# EAGLE design schV2.2 (EAGLE 9.6.2)
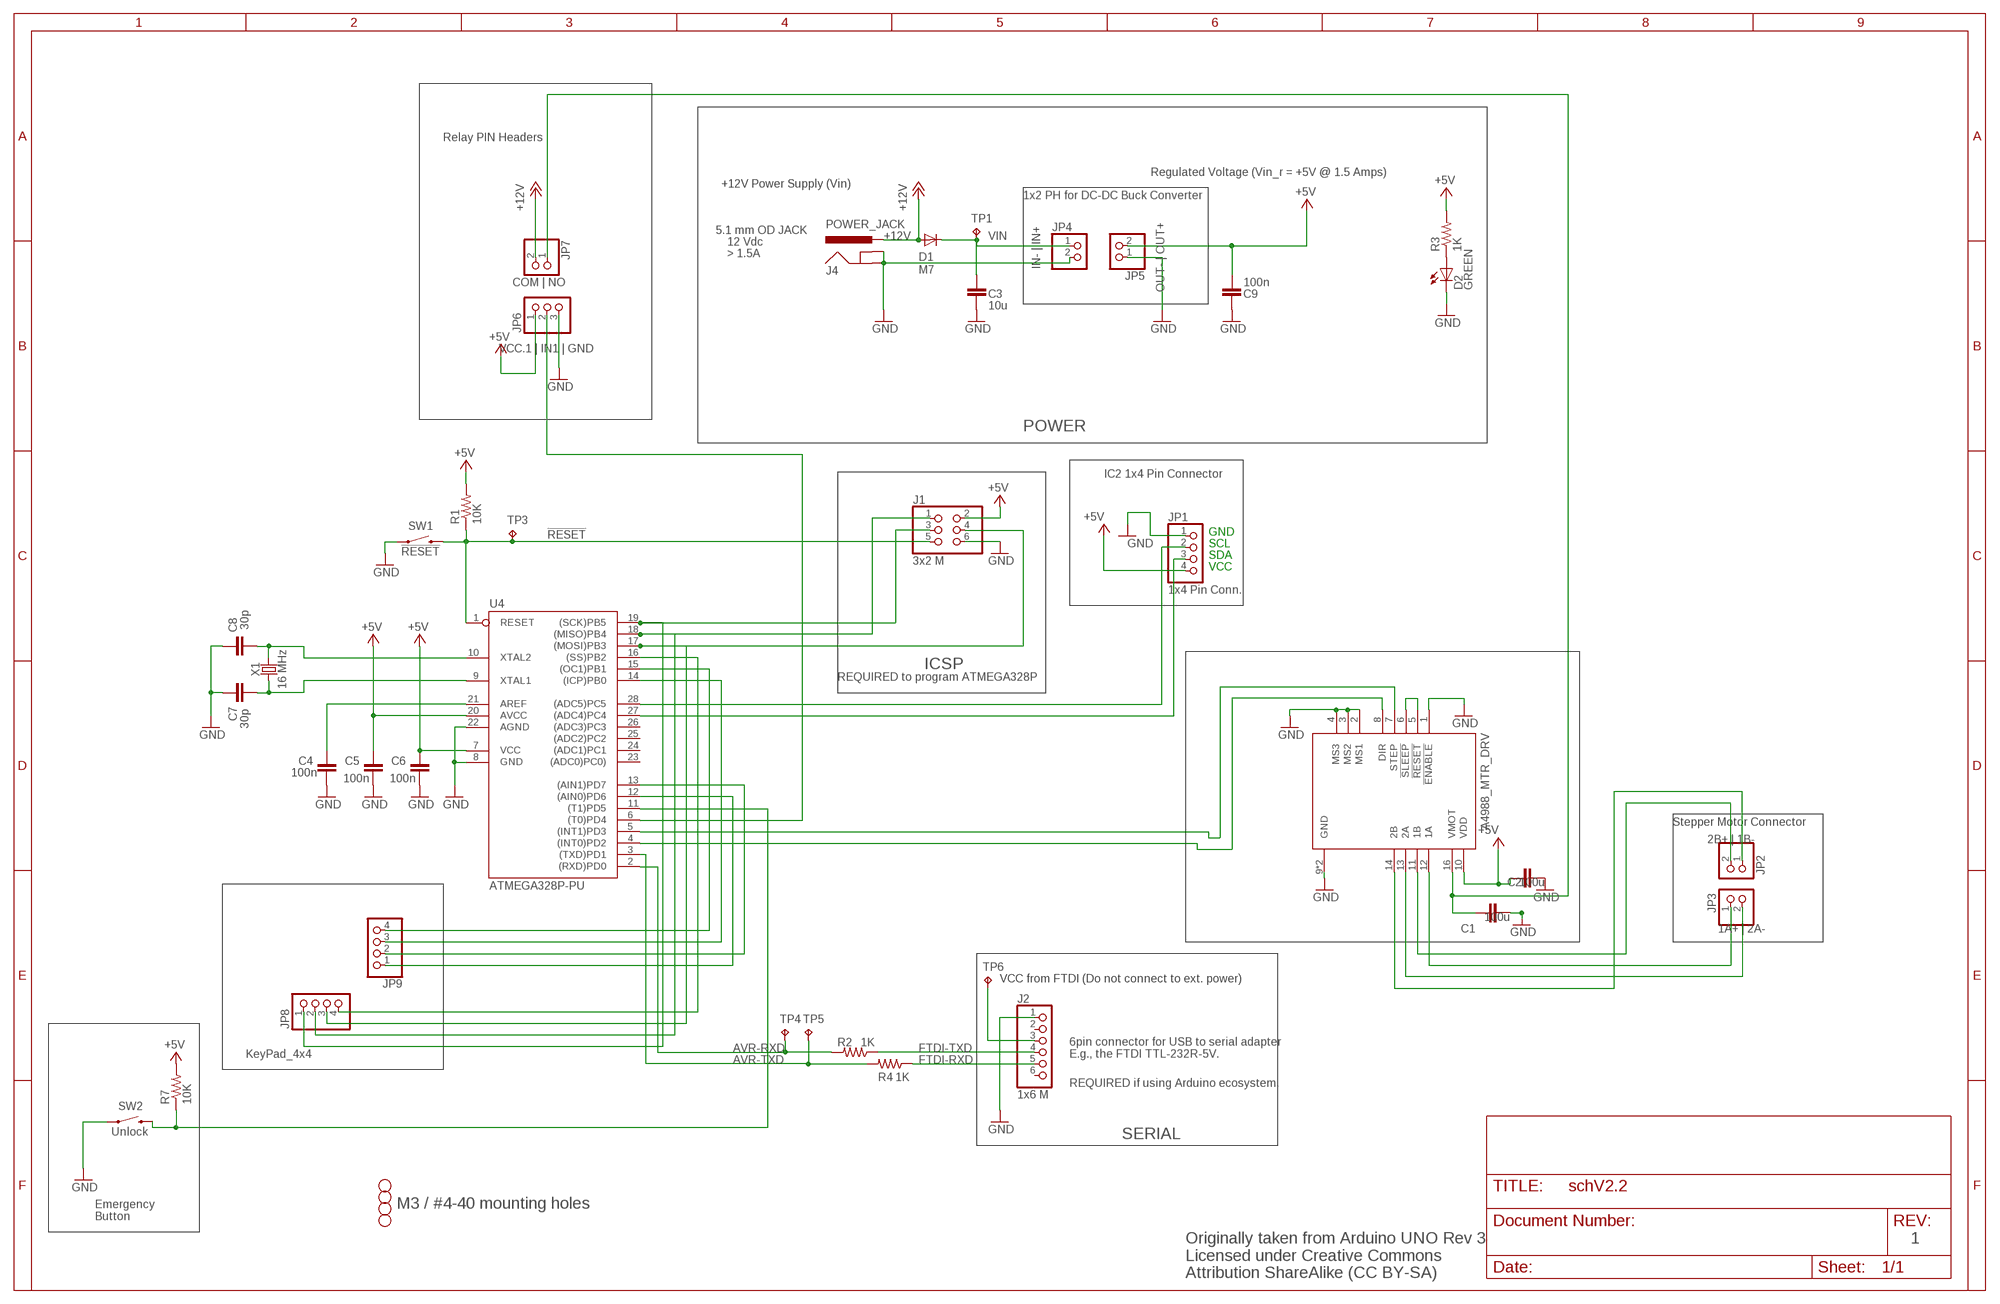
[diagram p0: schematic, sheet 1]

## Parts
A4988_MTR_DRV  A4988_STEPPER_MOTOR_DRIVER_CARRIER  [MODULE_A4988_STEPPER_MOTOR_DRIVER_CARRIER]
C1  100u  C-EUC0805K  [C0805K]
C2  100u  C-EUC0805K  [C0805K]
C3  10u  C-EUC0805K  [C0805K]
C4  100n  C-EUC0805K  [C0805K]
C5  100n  C-EUC0805K  [C0805K]
C6  100n  C-EUC0805K  [C0805K]
C7  30p  C-EUC0805K  [C0805K]
C8  30p  C-EUC0805K  [C0805K]
C9  100n  C-EUC0805K  [C0805K]
D1  M7  DIODE-SMB  [SMB]
D2  GREEN  LEDCHIP-LED0805  [CHIP-LED0805]
H1  STAND-OFF  [STAND-OFF]
H2  STAND-OFF  [STAND-OFF]
H3  STAND-OFF  [STAND-OFF]
H4  STAND-OFF  [STAND-OFF]
J1  3x2 M  PINHD-2X3  [2X03]
J2  1x6 M  PINHD-1X6  [1X06]
J4  POWER_JACK  [POWER_JACK_PTH]
JP1  1x4 Pin Conn.  PINHD-1X4  [1X04]
JP2  2B+ | 1B-  PINHD-1X2  [1X02]
JP3  1A+ | 2A-  PINHD-1X2  [1X02]
JP4  IN- | IN+  PINHD-1X2  [1X02]
JP5  OUT- | OUT+  PINHD-1X2  [1X02]
JP6  VCC.1 | IN1 | GND  PINHD-1X3  [1X03]
JP7  COM | NO  PINHD-1X2  [1X02]
JP8  PINHD-1X4  [1X04]
JP9  PINHD-1X4  [1X04]
R1  10K  R-US_R0805  [R0805]
R2  1K  R-US_R0805  [R0805]
R3  1K  R-US_R0805  [R0805]
R4  1K  R-US_R0805  [R0805]
R7  10K  R-US_R0805  [R0805]
SW1  !RESET  SWITCH-MOMENTARY-2SMD  [TACTILE_SWITCH_SMD]
SW2  Unlock  SWITCH-MOMENTARY-2SMD  [TACTILE_SWITCH_SMD]
TP1  TPPAD1-13  [P1-13]
TP3  TPPAD1-13  [P1-13]
TP4  TPPAD1-13  [P1-13]
TP5  TPPAD1-13  [P1-13]
TP6  TPPAD1-13  [P1-13]
U4  ATMEGA328P-PU  [DIL28-3]
X1  16 MHz  CRYSTALSMD-HC49UP  [HC49UP]

## Nets
!RESET: J1.5 R1.1 SW1.3 TP3.TP U4.1(RESET)
+5V: A4988_MTR_DRV.10(VDD) C2.2 C5.2 C6.2 C9.2 J1.2 JP1.4 JP5.2 JP6.1 R1.2 R3.2 R7.2 U4.7(VCC) U4.20(AVCC)
+12V: D1.A J4.PWR JP7.2
AVR-RXD: R2.2 TP4.TP U4.2((RXD)PD0)
AVR-TXD: R4.2 TP5.TP U4.3((TXD)PD1)
FTDI-RXD: J2.5 R4.1
FTDI-TXD: J2.4 R2.1
GND: A4988_MTR_DRV.1(!ENABLE) A4988_MTR_DRV.2(MS1) A4988_MTR_DRV.3(MS2) A4988_MTR_DRV.4(MS3) A4988_MTR_DRV.9(GND) A4988_MTR_DRV.15(GND) C1.1 C2.1 C3.2 C4.1 C5.1 C6.1 C7.2 C8.2 C9.1 D2.C J1.6 J2.1 J4.GND J4.GNDBREAK JP1.1 JP4.2 JP5.1 JP6.3 SW1.1 SW2.1 U4.8(GND) U4.22(AGND)
MISO: J1.1 JP8.2 U4.18((MISO)PB4)
MOSI: J1.4 JP8.3 U4.17((MOSI)PB3)
N$1: C4.2 U4.21(AREF)
N$2: A4988_MTR_DRV.8(DIR) U4.4((INT0)PD2)
N$3: D2.A R3.1
N$4: A4988_MTR_DRV.7(STEP) U4.5((INT1)PD3)
N$5: J2.3 TP6.TP
N$6: JP1.3 U4.27((ADC4)PC4)
N$8: A4988_MTR_DRV.11(1B) JP2.2
N$9: A4988_MTR_DRV.12(1A) JP3.1
N$10: A4988_MTR_DRV.13(2A) JP3.2
N$11: A4988_MTR_DRV.14(2B) JP2.1
N$12: JP1.2 U4.28((ADC5)PC5)
N$14: JP9.1 U4.12((AIN0)PD6)
N$15: JP9.2 U4.13((AIN1)PD7)
N$16: JP9.3 U4.14((ICP)PB0)
N$17: JP9.4 U4.15((OC1)PB1)
N$18: JP8.4 U4.16((SS)PB2)
N$20: JP6.2 U4.6((T0)PD4)
N$21: R7.1 SW2.3 U4.11((T1)PD5)
N$22: A4988_MTR_DRV.5(!RESET) A4988_MTR_DRV.6(!SLEEP)
N$23: A4988_MTR_DRV.16(VMOT) C1.2 JP7.1
SCK: J1.3 JP8.1 U4.19((SCK)PB5)
VIN: C3.1 D1.C JP4.1 TP1.TP
XTAL1: C7.1 U4.9(XTAL1) X1.1
XTAL2: C8.1 U4.10(XTAL2) X1.2
Unconnected: J2.2 J2.6 U4.23((ADC0)PC0)) U4.24((ADC1)PC1) U4.25((ADC2)PC2) U4.26((ADC3)PC3)

## Notes on the sheet
- Relay PIN Headers
- Regulated Voltage (Vin_r = +5V @ 1.5 Amps)
- +12V Power Supply (Vin)
- 1x2 PH for DC-DC Buck Converter
- 5.1 mm OD JACK
- 12 Vdc
- > 1.5A
- POWER
- IC2 1x4 Pin Connector
- GND
- SCL
- SDA
- VCC
- ICSP
- REQUIRED to program ATMEGA328P
- Stepper Motor Connector
- VCC from FTDI (Do not connect to ext. power)
- KeyPad_4x4
- 6pin connector for USB to serial adapter
  E.g., the FTDI TTL-232R-5V.
- REQUIRED if using Arduino ecosystem.
- SERIAL
- M3 / #4-40 mounting holes
- Emergency
  Button
- 1
- Originally taken from Arduino UNO Rev 3
  Licensed under Creative Commons 
  Attribution ShareAlike (CC BY-SA)

## Library data of the parts
A4988_MTR_DRV = A4988_STEPPER_MOTOR_DRIVER_CARRIER:A4988_STEPPER_MOTOR_DRIVER_CARRIER: Stepper motor controler; IC: A4988; 1A; Uin mot: 8÷35V; AVAILABILITY: Unavailable; DESCRIPTION: Stepper Motor Driver; MF: Pololu; MP: A4988 STEPPER MOTOR DRIVER CARRIER; PACKAGE: None; PRICE: None
C1 C2 C4-C6 C9 = rcl:C-EU: CAPACITOR, European symbol; MFR: Samsung; MPN: CL21B104KBCNNNC; SPICEPREFIX: C
C3 = rcl:C-EU: CAPACITOR, European symbol; MFR: Samsung; MPN: CL21A106KOQNNNG; SPICEPREFIX: C
C7 = rcl:C-EU: CAPACITOR, European symbol; DESC: CAP CER 30PF 50V C0G/NP0 0805; MFR: Samsung; MPN: CL21C180JBANNNC; SPICEPREFIX: C
C8 = rcl:C-EU: CAPACITOR, European symbol; DESC: CAP CER 30PF 50V C0G/NP0 0805; MFR: Samsung; MPN: CL21C300JBANNNC; SPICEPREFIX: C
D1 = diode:DIODE-: DIODE; MFR: SMC Diode; MPN: 10BQ030TR
D2 = led:LED: LED OSRAM: - CHIPLED LG R971, LG N971, LY N971, LG Q971, LY Q971, LO R971, LY R971 LH N974, LH R974 LS Q976, LO Q976, LY Q976 LO Q996 - Hyper CHIPLED LW Q18S LB Q993, LB Q99A, LB R99A - SideLED LS A670, LO A670, LY A670, LG A670, LP A670 LB A673, LV A673, LT A673, LW A673 LH A674 LY A675 LS A676, LA A676, LO A676, LY A676, LW A676 LS A679, LY A679, LG A679 - Hyper Micro SIDELED® LS Y876, LA Y876, LO Y876, LY Y876 LT Y87S - SmartLED LW L88C, LW L88S LB L89C, LB L89S, LG L890 LS L89K, LO L89K, LY L89K LS L896, LA L896, LO L896, LY L896 - TOPLED LS T670, LO T670, LY T670, LG T670, LP T670 LSG T670, LSP T670, LSY T670, LOP T670, LYG T670 LG T671, LOG T671, LSG T671 LB T673, LV T673, LT T673, LW T673 LH T674 LS T676, LA T676, LO T676, LY T676, LB T676, LH T676, LSB T676, LW T676 LB T67C, LV T67C, LT T67C, LS T67K, LO T67K, LY T67K, LW E67C LS E67B, LA E67B, LO E67B, LY E67B, LB E67C, LV E67C, LT E67C LW T67C LS T679, LY T679, LG T679 LS T770, LO T770, LY T770, LG T770, LP T770 LB T773, LV T773, LT T773, LW T773 LH T774 LS E675, LA E675, LY E675, LS T675 LS T776, LA T776, LO T776, LY T776, LB T776 LHGB T686 LT T68C, LB T68C - Hyper Mini TOPLED® LB M676 - Mini TOPLED Santana® LG M470 LS M47K, LO M47K, LY M47K Source: http://www.osram.convergy.de LUXEON: - LUMILED® LXK2-PW12-R00, LXK2-PW12-S00, LXK2-PW14-U00, LXK2-PW14-V00 LXK2-PM12-R00, LXK2-PM12-S00, LXK2-PM14-U00 LXK2-PE12-Q00, LXK2-PE12-R00, LXK2-PE12-S00, LXK2-PE14-T00, LXK2-PE14-U00 LXK2-PB12-K00, LXK2-PB12-L00, LXK2-PB12-M00, LXK2-PB14-N00, LXK2-PB14-P00, LXK2-PB14-Q00 LXK2-PR12-L00, LXK2-PR12-M00, LXK2-PR14-Q00, LXK2-PR14-R00 LXK2-PD12-Q00, LXK2-PD12-R00, LXK2-PD12-S00 LXK2-PH12-R00, LXK2-PH12-S00 LXK2-PL12-P00, LXK2-PL12-Q00, LXK2-PL12-R00 Source: www.luxeon.com KINGBRIGHT: KA-3528ASYC Source: www.kingbright.com; MFR: Würth Elektronik; MPN: 150080GS75000
H1-H4 = SparkFun-Hardware:STAND-OFF: Stand Off Drill holes for mechanically mounting via screws, standoffs, etc. Note: Use the keepout ring to avoid running the screw head into surrounding components. Variant Overviews STAND-OFF - Mechanical footprint for a #4 phillips button head screw. STAND-OFF-TIGHT - Mechanical footprint for a #4 phillips button head screw, Example SparkFun Products Screw - Phillips Head (1/4", 4-40, 10 pack) <https://www.sparkfun.com/products/10453> (PRT-10453) Screw - Phillips Head (1/2", 4-40, 10 pack) <https://www.sparkfun.com/products/10452> (PRT-10452) Screw - Phillips Head (3/4", 4-40, 10 pack) <https://www.sparkfun.com/products/10451> (PRT-10451) Screw - Phillips Head (1", 4-40, 10 pack) <https://www.sparkfun.com/products/10450> (PRT-10450)
J1 = SmartPrj:PINHD-2X3: PIN HEADER; MFR: Harwin; MPN: M20-9980345
J2 = pinhead:PINHD-1X6: PIN HEADER; MFR: Sullins; MPN: PRPC006SAAN-RC
J4 = SparkFun-Connectors:POWER_JACK: Power Jack Connector This is the standard 5.5mm barrel jack for power. The PTH is the most common, proven, reliable, footprint. The Slot footprint only works if the mill layer is transmitted to the PCB fab house so be warned. Here are the connectors we sell at SparkFun: DC Barrel Power Jack/Connector <https://www.sparkfun.com/products/119> (PRT-00119) DC Barrel Power Jack/Connector (SMD) <https://www.sparkfun.com/products/12748> (PRT-12748) DC Barrel Jack Adapter - Breadboard Compatible <https://www.sparkfun.com/products/10811> (PRT-10811) It is used on this SparkFun product (and many, many others): SparkFun RedBoard - Programmed with Arduino <https://www.sparkfun.com/products/12757> (DEV-12757) Also, if you need a mating power supply or connector, please check these out: Wall Adapter Power Supply - 9VDC 650mA <https://www.sparkfun.com/products/298> (TOL-00298) DC Barrel Jack Adapter - Male <https://www.sparkfun.com/products/10287> (PRT-10287); MFR: CUI; MPN: PJ-202A; PROD_ID: CONN-08197
JP1 JP8 JP9 = pinhead:PINHD-1X4: PIN HEADER
JP2-JP5 JP7 = pinhead:PINHD-1X2: PIN HEADER
JP6 = pinhead:PINHD-1X3: PIN HEADER
R1 R7 = rcl:R-US_: RESISTOR, American symbol; MFR: Yageo; MPN: RC0805FR-0710KL; SPICEPREFIX: R
R2-R4 = rcl:R-US_: RESISTOR, American symbol; MFR: Yageo; MPN: RC0805FR-071KL; SPICEPREFIX: R
SW1 SW2 = SparkFun-Electromechanical:SWITCH-MOMENTARY-2: Various NO switches- pushbuttons, reed, etc; DESC: SWITCH TACTILE SPST-NO 0.05A 12V; MFR: C&K; MPN: RS-187R05A2-DS MT RT
TP1 TP3-TP6 = testpad:TP: Test pad
U4 = SmartPrj:ATMEGA328P-: MICROCONTROLLER 4 Kbytes FLASH 128 bytes SRAM 256 bytes EEPROM UART 6-channel 10 bit ADC; MFR: Microchip; MPN: ATMEGA328P-PU
X1 = SparkFun-Clocks:CRYSTAL: Crystals (Generic) These are passive quartz crystals, which can be used as a clock source for a microcontroller. Crystal's are two-terminal devices. They require external "load" capacitors to generate an oscillating signal.; DESC: CRYSTAL 16.000 MHZ 18PF SMD; MFR: ECS; MPN: ECS-160-18-5PX-TR

## Net classes
0 default: width 1.27 mm, clearance 0.254 mm

## Board
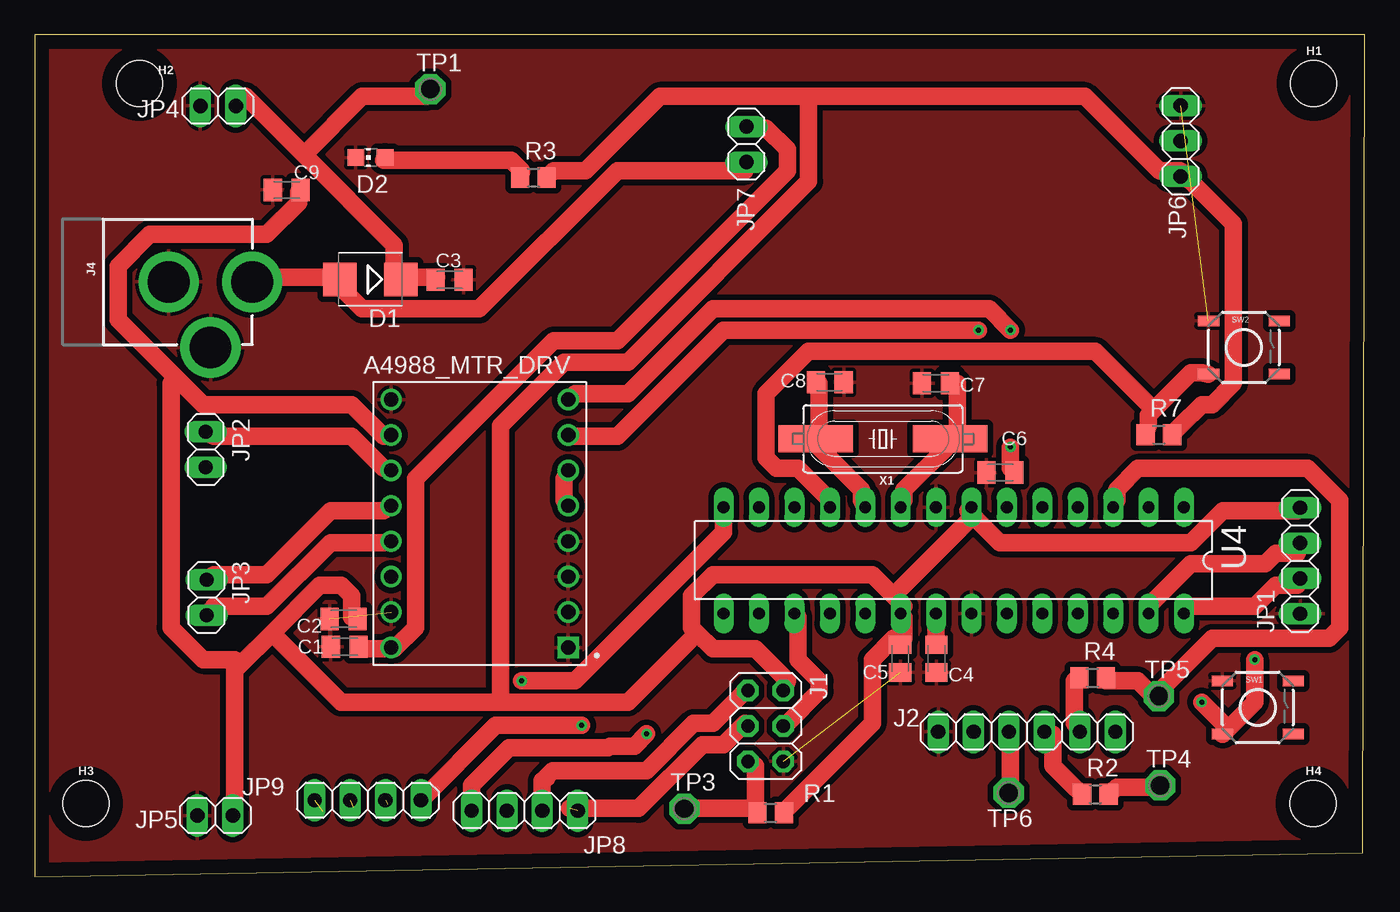
[diagram p1: board, top side]
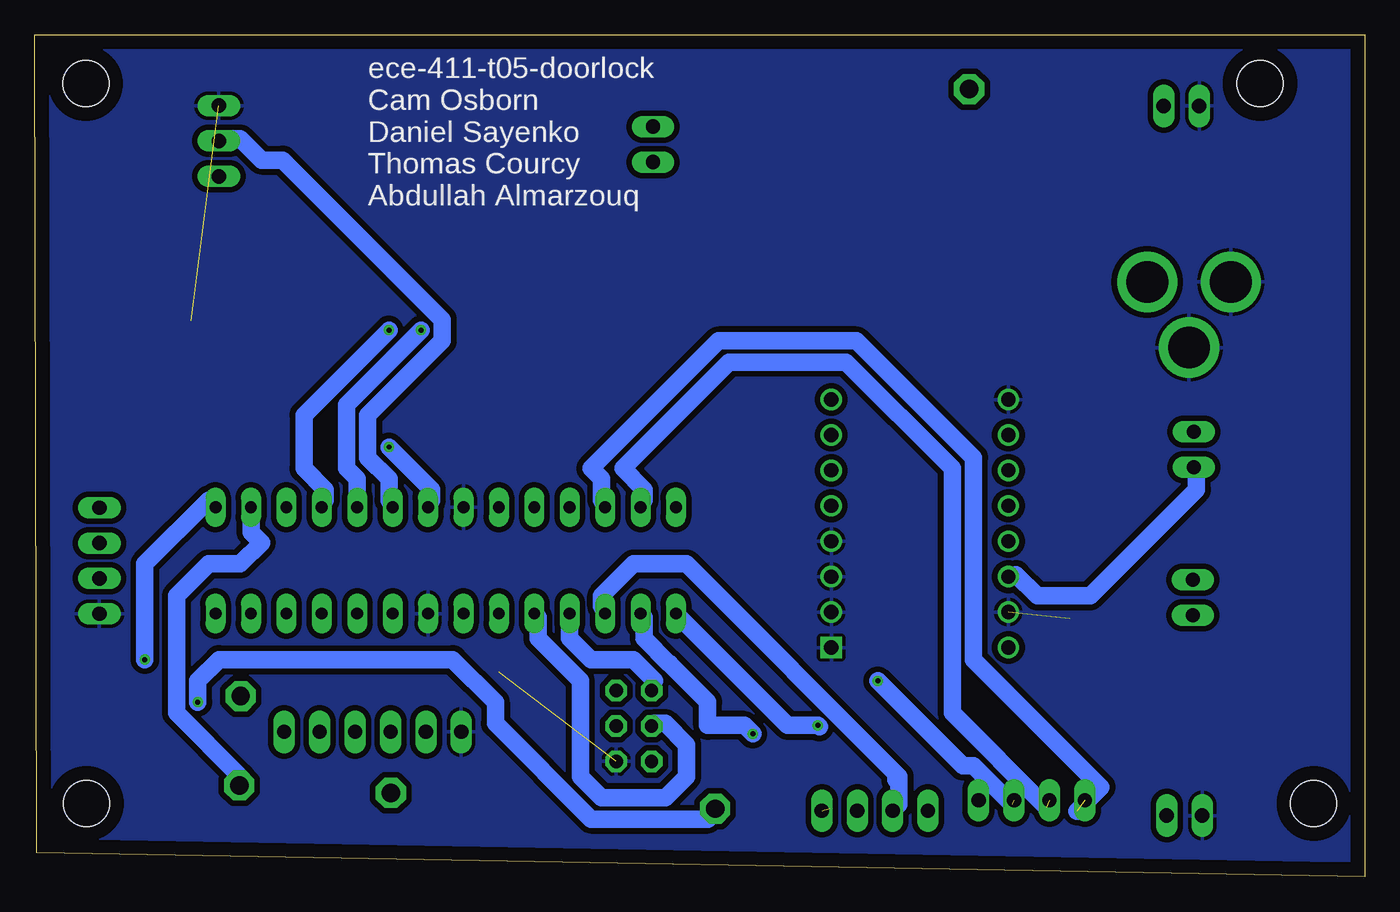
[diagram p2: board, bottom side, seen from below]

Size 95.38 x 60.38 mm. Coordinates in mm from the lower left corner, seen from the top.
Outline: 0,0 95.25,1.75 95.38,60.38 0,60.38 0,0
Copper layers (1*16): Top 0.035mm / dielectric 1.5mm / Bottom 0.035mm
Design rules "default": minimum track width 6mil, minimum drill 0.35mm, track to track 6mil, track to pad 6mil, pad to pad 6mil, via to via 6mil, smd to smd 6mil, copper to edge 40mil, drill to drill 6mil, minimum pad ring 10mil, minimum via ring 8mil, stop-mask expansion 4mil, vias tented up to drill 0mil, thermal gap 10mil

### Footprints (pad centres in the part's own frame; a part is rotated, then mirrored left to right if it is on the bottom)
MODULE_A4988_STEPPER_MOTOR_DRIVER_CARRIER = drill 1.02 square: 1 -6.35,8.89 | drill 1.02: 2 -6.35,6.35; 3 -6.35,3.81; 4 -6.35,1.27; 5 -6.35,-1.27; 6 -6.35,-3.81; 7 -6.35,-6.35; 8 -6.35,-8.89; 9 6.35,-8.89; 10 6.35,-6.35; 11 6.35,-3.81; 12 6.35,-1.27; 13 6.35,1.27; 14 6.35,3.81; 15 6.35,6.35; 16 6.35,8.89
C0805K = smd 1.3 x 1.6: 1 -1,0; 2 1,0
SMB = smd 2.4 x 2.4: A 2.2,0; C -2.2,0
CHIP-LED0805 = smd 1.2 x 1.2: A 0,-1.05; C 0,1.05
STAND-OFF = hole 3.302: 0,0
2X03 = drill 0.95 pad 1.55 octagon: 1 -2.54,-1.27; 2 -2.54,1.27; 3 0,-1.27; 4 0,1.27; 5 2.54,-1.27; 6 2.54,1.27
1X06 = drill 1.016 long: 1 -6.35,0; 2 -3.81,0; 3 -1.27,0; 4 1.27,0; 5 3.81,0; 6 6.35,0
POWER_JACK_PTH = drill 2.997 pad 4.318: GND 0,7.7; GNDBREAK 4.7,10.7; PWR 0,13.7
1X04 = drill 1.016 long: 1 -3.81,0; 2 -1.27,0; 3 1.27,0; 4 3.81,0
1X02 = drill 1.016 long: 1 -1.27,0; 2 1.27,0
1X03 = drill 1.016 long: 1 -2.54,0; 2 0,0; 3 2.54,0
R0805 = smd 1.3 x 1.5: 1 -0.95,0; 2 0.95,0
TACTILE_SWITCH_SMD = smd 1.524 x 0.762: 1 -2.54,1.905; 2 2.54,1.905; 3 -2.54,-1.905; 4 2.54,-1.905
P1-13 = drill 1.321 pad 2.159 octagon: TP 0,0
DIL28-3 = drill 0.85 pad 1.422 long: 1 -16.51,-3.81; 2 -13.97,-3.81; 3 -11.43,-3.81; 4 -8.89,-3.81; 5 -6.35,-3.81; 6 -3.81,-3.81; 7 -1.27,-3.81; 8 1.27,-3.81; 9 3.81,-3.81; 10 6.35,-3.81; 11 8.89,-3.81; 12 11.43,-3.81; 13 13.97,-3.81; 14 16.51,-3.81; 15 16.51,3.81; 16 13.97,3.81; 17 11.43,3.81; 18 8.89,3.81; 19 6.35,3.81; 20 3.81,3.81; 21 1.27,3.81; 22 -1.27,3.81; 23 -3.81,3.81; 24 -6.35,3.81; 25 -8.89,3.81; 26 -11.43,3.81; 27 -13.97,3.81; 28 -16.51,3.81
HC49UP = smd 5.334 x 1.93: 1 -4.826,0; 2 4.826,0

### Placement (x,y rotation side)
A4988_MTR_DRV  31.91,25.34 180 top
C1  22.23,16.51 0 top
C2  22.15,18.51 0 top
C3  29.75,42.81 0 top
C4  64.66,15.66 90 top
C5  62.07,15.66 90 top
C6  69.26,28.99 0 top
C7  64.64,35.39 180 top
C8  57.02,35.47 0 top
C9  18.07,49.26 0 top
D1  24.06,42.85 180 top
D2  24.07,51.58 90 top
H1  91.72,56.9 0 top
H2  7.5,56.9 0 top
H3  3.65,5.27 0 top
H4  91.67,5.27 0 top
J1  52.41,10.82 270 top
J2  71.14,10.4 0 top
J4  1.89,42.66 270 top
JP1  90.75,22.67 90 top
JP2  12.25,30.66 90 top
JP3  12.32,20.03 270 top
JP4  13.14,55.28 180 top
JP5  12.93,4.41 0 top
JP6  82.17,52.77 90 top
JP7  51.03,52.53 270 top
JP8  35.12,4.75 180 top
JP9  23.88,5.5 0 top
R1  52.77,4.6 0 top
R2  76.06,5.93 0 top
R3  35.76,50.15 0 top
R4  75.86,14.29 0 top
R7  80.61,31.71 0 top
SW1  87.71,12.15 0 top
SW2  86.71,37.96 0 top
TP1  28.37,56.48 0 top
TP3  46.59,4.89 0 top
TP4  80.71,6.57 0 top
TP5  80.61,12.97 0 top
TP6  69.84,6.03 0 top
U4  65.91,22.7 180 top
X1  60.83,31.41 180 top

### Tracks (layer width: path | path; a pad name or v marks a point on that pad's centre or on a via)
!RESET  (via drill 0.35)
  Top 1.27: 51.68,4.91 51.68,7.96 J1.5 | 51.68,4.91 47.11,4.91 TP3.TP | 51.68,4.91 R1.1 | 85.59,10.63 87.5,12.53 v87.5,15.58 | 85.59,10.63 85.21,10.25 SW1.3 | 85.59,10.63 v83.69,12.53
  Bottom 1.27: v87.5,15.58 87.5,22.44 82.92,27.01 U4.1 | v83.69,12.53 83.69,14.06 82.16,15.58 65.4,15.58 62.35,12.53 62.35,11.01 55.49,4.15 47.11,4.15 TP3.TP
+5V  (via drill 0.35)
  Top 1.27: 55.49,55.97 75.3,55.97 80.64,50.64 82.16,50.64 JP6.1 82.92,49.87 85.97,46.83 85.97,35.39 84.45,33.87 83.69,33.87 82.16,32.35 R7.2 | 55.49,55.97 44.82,55.97 39.49,50.64 37.2,50.64 R3.2 | 14.72,15.2 14.34,14.82 14.34,4.91 JP5.2 | 14.72,15.2 17.01,17.49 | 17.01,17.49 20.44,20.92 21.96,20.92 22.73,20.16 22.73,18.63 C2.2 | 10.15,35.78 12.06,33.87 22.73,33.87 25.01,31.59 A4988_MTR_DRV.10 | 10.15,35.78 5.96,39.97 5.96,43.78 8.25,46.06 16.63,46.06 18.91,48.35 18.91,49.11 C9.2 | 14.72,15.2 14.34,15.58 12.06,15.58 9.77,17.87 9.77,35.39 10.15,35.78 | v69.97,30.82 69.97,29.3 C6.2 | JP1.4 90.54,26.25 85.21,26.25 82.92,23.97 69.21,23.97 66.92,26.25 U4.7 66.92,25.49 61.59,20.16 | R1.2 53.97,4.91 60.06,11.01 60.06,15.58 61.59,17.11 C5.2 62.35,17.11 62.35,18.63 U4.20 62.35,19.39 61.59,20.16 | 47.49,17.49 47.11,17.87 47.11,20.16 48.63,21.68 60.06,21.68 61.59,20.16 | 47.49,17.49 48.63,16.34 51.68,16.34 53.97,14.06 J1.2 | 17.01,17.49 21.96,12.53 33.39,12.53 | 33.39,12.53 42.54,12.53 47.49,17.49 | 55.49,55.97 55.49,49.87 42.54,36.92 37.97,36.92 33.39,32.35 33.39,12.53
  Bottom 1.27: v69.97,30.82 66.92,27.77 66.92,27.01 U4.7
+12V
  Top 1.27: J4.PWR 15.87,43.02 21.2,43.02 D1.A 21.96,42.25 23.49,40.73 31.87,40.73 41.77,50.64 50.92,50.64 JP7.2
AVR-RXD
  Top 1.27: R2.2 77.59,6.44 80.64,6.44 TP4.TP
  Bottom 1.27: U4.2 79.88,24.73 79.11,23.97 80.64,22.44 82.92,22.44 85.21,20.16 85.21,11.77 80.64,7.2 TP4.TP
AVR-TXD
  Top 1.27: R4.2 76.83,14.06 79.11,14.06 79.88,13.3 TP5.TP 80.64,13.3 84.45,17.11 92.83,17.11 93.59,17.87 93.59,27.01 91.31,29.3 79.11,29.3 77.59,27.77 77.59,27.01 U4.3
FTDI-RXD
  Top 1.27: R4.1 74.54,14.06 74.54,11.01 J2.5
FTDI-TXD
  Top 1.27: R2.1 74.54,6.44 73.02,7.96 73.02,10.25 J2.4
GND  (3 unrouted)
  pour Top (isolate 0.406): 0,60.38 0,0 95.25,0 95.25,60.38
  pour Bottom (isolate 0.406): 0,60.38 0,1.12 95.25,1.12 95.25,60.38
MISO
  Top 1.27: J1.1 50.92,13.3 48.63,11.01 47.24,11.01 43.85,7.62 37.12,7.62 36.62,7.12 | 36.75,7.12 36.62,7.12 | 36.62,7.12 36.4,6.9 JP8.2
  Bottom 1.27: U4.18 57.02,17.11 55.49,15.58 52.44,15.58 50.92,14.06 J1.1
MOSI
  Top 1.27: U4.17 54.73,18.63 54.73,15.58 56.25,14.06 56.25,13.3 53.97,11.01 J1.4
  Bottom 1.27: 33.39,7.2 33.63,6.96 | 33.39,7.2 48.63,22.44 52.44,22.44 54.73,20.16 54.73,19.39 U4.17 | 33.39,7.2 33.39,5.21 JP8.3
N$1
  Top 1.27: U4.21 64.64,17.11 C4.2
N$2  (via drill 0.35)
  Top 1.27: v69.97,39.2 68.44,40.73 48.63,40.73 42.54,34.63 38.73,34.63 A4988_MTR_DRV.8
  Bottom 1.27: v69.97,39.2 76.06,33.11 76.06,29.3 74.54,27.77 74.54,27.01 U4.4
N$3
  Top 1.27: D2.A 25.01,51.4 34.16,51.4 34.92,50.64 R3.1
N$4  (via drill 0.35)
  Top 1.27: v67.68,39.2 49.39,39.2 41.77,31.59 38.73,31.59 A4988_MTR_DRV.7
  Bottom 1.27: U4.5 72.25,28.54 73.02,29.3 73.02,33.87 v67.68,39.2
N$5
  Top 1.27: J2.3 69.97,10.25 69.97,6.44 TP6.TP
N$6
  Top 1.27: U4.27 79.88,19.39 82.92,22.44 88.26,22.44 89.02,23.2 90.54,23.2 JP1.3
N$8
  Top 1.27: JP2.2 12.82,31.59 22.73,31.59 25.01,29.3 A4988_MTR_DRV.11
N$9
  Top 1.27: JP3.1 12.82,21.68 16.63,21.68 21.2,26.25 25.01,26.25 A4988_MTR_DRV.12
N$10
  Top 1.27: JP3.2 12.82,19.39 16.63,19.39 21.2,23.97 25.01,23.97 A4988_MTR_DRV.13
N$11
  Bottom 1.27: JP2.1 12.06,29.3 12.06,27.77 19.68,20.16 23.49,20.16 25.01,21.68 A4988_MTR_DRV.14
N$12
  Top 1.27: U4.28 82.92,19.39 87.5,19.39 89.02,20.92 90.54,20.92 JP1.2
N$14  (1 unrouted)
  Bottom 1.27: 20.63,4.72 18.91,6.44 28.06,15.58 28.06,30.06 36.44,38.44 46.35,38.44 55.49,29.3 54.73,28.54 54.73,27.01 U4.12
N$15  (1 unrouted)
  Bottom 1.27: 22.81,5.01 29.58,11.77 29.58,29.3 37.2,36.92 45.59,36.92 53.2,29.3 51.68,27.77 51.68,27.01 U4.13
N$16  (via drill 0.35)  (1 unrouted)
  Top 1.27: U4.14 49.39,24.73 38.73,14.06 v34.92,14.06
  Bottom 1.27: v34.92,14.06 28.82,7.96 28.06,7.96 25.31,5.22
N$17  (via drill 0.35)
  Top 1.27: v39.22,10.88 33.06,10.88 JP9.4
  Bottom 1.27: U4.15 41.38,10.88 v39.22,10.88 39.11,10.76
N$18  (via drill 0.35)
  Top 1.27: JP8.4 31.31,6.56 34.01,9.26 41.13,9.26 41.25,9.39 43,9.39 v43.88,10.26
  Bottom 1.27: U4.16 51.68,18.63 51.68,17.11 49.91,15.34 49.86,15.32 49.82,15.24 47.12,12.55 47.12,10.88 44.49,10.88 v43.88,10.26
N$20
  Bottom 1.27: U4.6 69.97,27.01 69.97,28.54 71.49,30.06 71.49,33.11 66.16,38.44 66.16,39.97 77.59,51.4 79.11,51.4 80.64,52.92 82.16,52.92 JP6.2
N$21
  Top 1.27: 80.26,33.49 82.92,36.16 83.69,36.16 SW2.3 | 80.26,33.49 79.88,33.11 79.88,32.35 R7.1 | 80.26,33.49 76.06,37.68 55.49,37.68 52.44,34.63 52.44,30.06 53.2,29.3 54.73,29.3 57.02,27.01 U4.11
N$22
  Top 1.27: A4988_MTR_DRV.5 37.97,27.01 37.97,28.54 A4988_MTR_DRV.6
N$23
  Top 1.27: C1.2 23.49,16.34 25.01,16.34 A4988_MTR_DRV.16 25.77,16.34 27.3,17.87 27.3,28.54 37.2,38.44 41.77,38.44 53.97,50.64 53.97,52.16 52.44,53.68 51.68,53.68 JP7.1
SCK  (1 unrouted)
  Top 1.27: 38.36,4.91 43.3,4.91 47.87,9.49 49.39,9.49 50.92,11.01 J1.3
  Bottom 1.27: U4.19 59.3,18.63 59.3,17.11 56.25,14.06 56.25,7.2 54.73,5.68 50.16,5.68 48.63,7.2 48.63,9.49 50.16,11.01 50.92,11.01 J1.3
VIN
  Top 1.27: C3.1 28.82,43.02 26.53,43.02 D1.C 25.77,43.02 25.77,45.3 19.3,51.78 | 19.3,51.78 15.11,55.97 JP4.1 | 19.3,51.78 23.49,55.97 28.06,55.97 TP1.TP
XTAL1
  Top 1.27: C7.1 66.16,35.39 66.16,31.59 X1.1 65.4,30.82 62.35,27.77 62.35,27.01 U4.9
XTAL2
  Top 1.27: C8.1 56.25,35.39 56.25,31.59 X1.2 56.25,30.82 59.3,27.77 59.3,27.01 U4.10

### Text on the board
bPlace: ece-411-t05-doorlock / Cam Osborn / Daniel Sayenko / Thomas Courcy / Abdullah Almarzouq